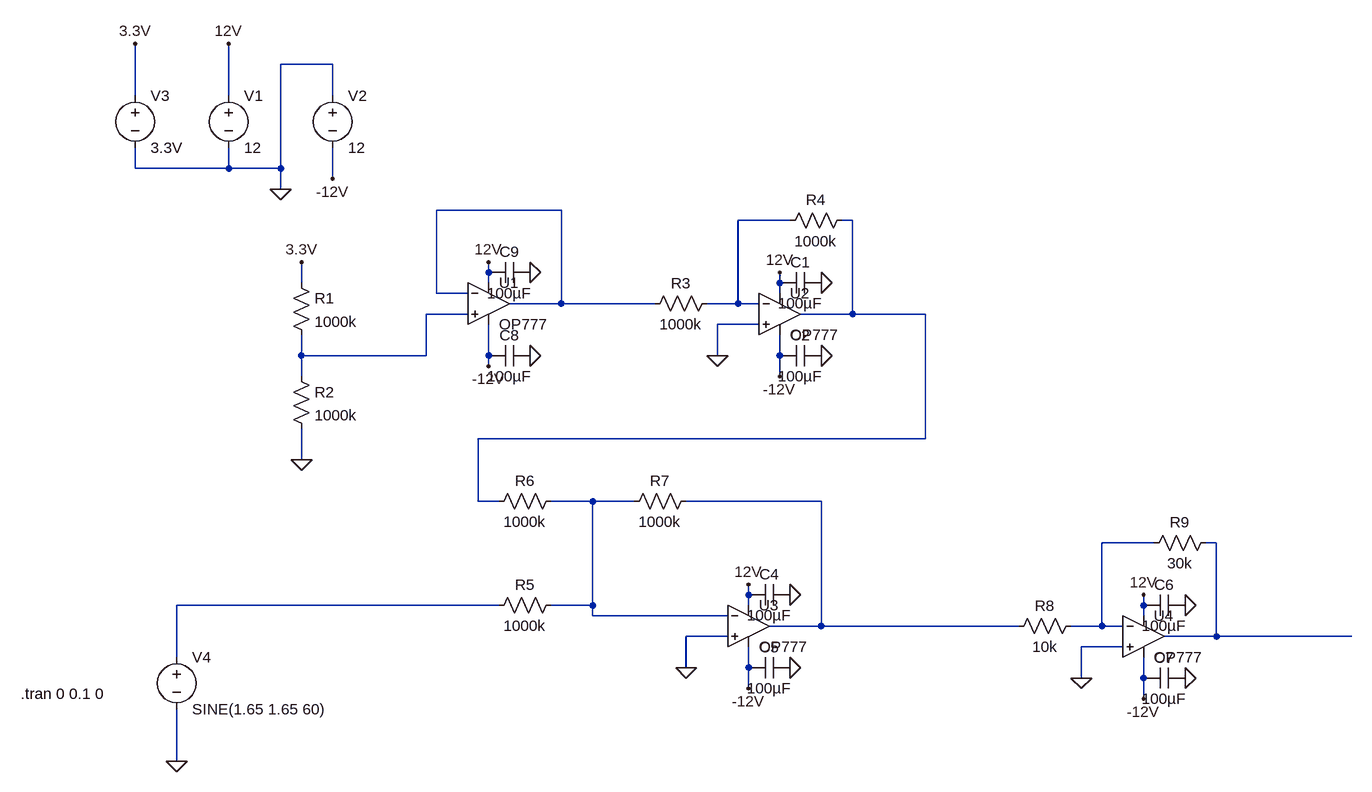
[diagram p0: schematic Output.asc]
Output.asc, the LTspice schematic file:
Version 4
SHEET 1 2004 912
WIRE -48 -192 -128 -192
WIRE -352 -144 -352 -224
WIRE -208 -144 -208 -224
WIRE -48 -144 -48 -192
WIRE -352 -32 -352 -64
WIRE -208 -32 -208 -64
WIRE -208 -32 -352 -32
WIRE -128 -32 -128 -192
WIRE -128 -32 -208 -32
WIRE -48 -16 -48 -64
WIRE -128 0 -128 -32
WIRE 304 32 112 32
WIRE 656 48 576 48
WIRE 752 48 736 48
WIRE 192 128 192 112
WIRE -96 144 -96 112
WIRE 192 144 192 128
WIRE 640 144 640 128
WIRE 112 160 112 32
WIRE 160 160 112 160
WIRE 640 160 640 144
WIRE 304 176 304 32
WIRE 304 176 224 176
WIRE 448 176 304 176
WIRE 576 176 576 48
WIRE 576 176 528 176
WIRE 608 176 576 176
WIRE 160 192 96 192
WIRE 752 192 752 48
WIRE 752 192 672 192
WIRE 864 192 752 192
WIRE 608 208 544 208
WIRE -96 256 -96 224
WIRE 96 256 96 192
WIRE 96 256 -96 256
WIRE 192 256 192 208
WIRE 544 256 544 208
WIRE 640 256 640 224
WIRE 192 272 192 256
WIRE -96 288 -96 256
WIRE 640 288 640 256
WIRE 864 384 864 192
WIRE 864 384 176 384
WIRE -96 416 -96 368
WIRE 176 480 176 384
WIRE 208 480 176 480
WIRE 352 480 288 480
WIRE 416 480 352 480
WIRE 704 480 496 480
WIRE 1216 544 1136 544
WIRE 1312 544 1296 544
WIRE 592 624 592 608
WIRE 208 640 -288 640
WIRE 352 640 352 480
WIRE 352 640 288 640
WIRE 592 640 592 624
WIRE 1200 640 1200 624
WIRE 352 656 352 640
WIRE 560 656 352 656
WIRE 1200 656 1200 640
WIRE 704 672 704 480
WIRE 704 672 624 672
WIRE 1008 672 704 672
WIRE 1136 672 1136 544
WIRE 1136 672 1088 672
WIRE 1168 672 1136 672
WIRE 560 688 496 688
WIRE 1312 688 1312 544
WIRE 1312 688 1232 688
WIRE 1520 688 1312 688
WIRE 1168 704 1104 704
WIRE -288 720 -288 640
WIRE 496 736 496 688
WIRE 592 736 592 704
WIRE 1104 752 1104 704
WIRE 1200 752 1200 720
WIRE 592 768 592 736
WIRE 1200 784 1200 752
WIRE -288 880 -288 800
FLAG -128 0 0
FLAG -208 -224 12V
FLAG -48 -16 -12V
FLAG 192 272 -12V
FLAG 192 112 12V
FLAG -352 -224 3.3V
FLAG -96 112 3.3V
FLAG -96 416 0
FLAG -288 880 0
FLAG 592 768 -12V
FLAG 592 608 12V
FLAG 1200 784 -12V
FLAG 1200 624 12V
FLAG 496 736 0
FLAG 1104 752 0
FLAG 656 624 0
FLAG 656 736 0
FLAG 1264 640 0
FLAG 1264 752 0
FLAG 256 256 0
FLAG 256 128 0
FLAG 640 288 -12V
FLAG 640 128 12V
FLAG 544 256 0
FLAG 704 144 0
FLAG 704 256 0
SYMBOL voltage -208 -160 R0
WINDOW 123 0 0 Left 0
WINDOW 39 0 0 Left 0
SYMATTR InstName V1
SYMATTR Value 12
SYMBOL voltage -48 -160 R0
WINDOW 123 0 0 Left 0
WINDOW 39 0 0 Left 0
SYMATTR InstName V2
SYMATTR Value 12
SYMBOL voltage -352 -160 R0
WINDOW 123 0 0 Left 0
WINDOW 39 0 0 Left 0
SYMATTR InstName V3
SYMATTR Value 3.3V
SYMBOL res -112 128 R0
SYMATTR InstName R1
SYMATTR Value 1000k
SYMBOL res -112 272 R0
SYMATTR InstName R2
SYMATTR Value 1000k
SYMBOL voltage -288 704 R0
WINDOW 123 0 0 Left 0
WINDOW 39 0 0 Left 0
SYMATTR InstName V4
SYMATTR Value SINE(1.65 1.65 60)
SYMBOL res 304 624 R90
WINDOW 0 0 56 VBottom 2
WINDOW 3 32 56 VTop 2
SYMATTR InstName R5
SYMATTR Value 1000k
SYMBOL res 304 464 R90
WINDOW 0 0 56 VBottom 2
WINDOW 3 32 56 VTop 2
SYMATTR InstName R6
SYMATTR Value 1000k
SYMBOL res 512 464 R90
WINDOW 0 0 56 VBottom 2
WINDOW 3 32 56 VTop 2
SYMATTR InstName R7
SYMATTR Value 1000k
SYMBOL res 1104 656 R90
WINDOW 0 0 56 VBottom 2
WINDOW 3 32 56 VTop 2
SYMATTR InstName R8
SYMATTR Value 10k
SYMBOL res 1312 528 R90
WINDOW 0 0 56 VBottom 2
WINDOW 3 32 56 VTop 2
SYMATTR InstName R9
SYMATTR Value 30k
SYMBOL cap 656 608 R90
WINDOW 0 0 32 VBottom 2
WINDOW 3 32 32 VTop 2
SYMATTR InstName C4
SYMATTR Value 100µF
SYMBOL cap 656 720 R90
WINDOW 0 0 32 VBottom 2
WINDOW 3 32 32 VTop 2
SYMATTR InstName C5
SYMATTR Value 100µF
SYMBOL cap 1264 624 R90
WINDOW 0 0 32 VBottom 2
WINDOW 3 32 32 VTop 2
SYMATTR InstName C6
SYMATTR Value 100µF
SYMBOL cap 1264 736 R90
WINDOW 0 0 32 VBottom 2
WINDOW 3 32 32 VTop 2
SYMATTR InstName C7
SYMATTR Value 100µF
SYMBOL cap 256 240 R90
WINDOW 0 0 32 VBottom 2
WINDOW 3 32 32 VTop 2
SYMATTR InstName C8
SYMATTR Value 100µF
SYMBOL cap 256 112 R90
WINDOW 0 0 32 VBottom 2
WINDOW 3 32 32 VTop 2
SYMATTR InstName C9
SYMATTR Value 100µF
SYMBOL Opamps\\OP777 192 112 R0
SYMATTR InstName U1
SYMBOL Opamps\\OP777 592 608 R0
SYMATTR InstName U3
SYMBOL Opamps\\OP777 1200 624 R0
SYMATTR InstName U4
SYMBOL res 544 160 R90
WINDOW 0 0 56 VBottom 2
WINDOW 3 32 56 VTop 2
SYMATTR InstName R3
SYMATTR Value 1000k
SYMBOL res 752 32 R90
WINDOW 0 0 56 VBottom 2
WINDOW 3 32 56 VTop 2
SYMATTR InstName R4
SYMATTR Value 1000k
SYMBOL cap 704 128 R90
WINDOW 0 0 32 VBottom 2
WINDOW 3 32 32 VTop 2
SYMATTR InstName C1
SYMATTR Value 100µF
SYMBOL cap 704 240 R90
WINDOW 0 0 32 VBottom 2
WINDOW 3 32 32 VTop 2
SYMATTR InstName C2
SYMATTR Value 100µF
SYMBOL Opamps\\OP777 640 128 R0
SYMATTR InstName U2
TEXT -528 776 Left 2 !.tran 0 0.1 0

The netlist it stands for:
* Output.asc
V1 12V 0 12
V2 0 -12V 12
V3 3.3V 0 3.3V
R1 3.3V N004 1000k
R2 N004 0 1000k
V4 N009 0 SINE(1.65 1.65 60)
R5 N005 N009 1000k
R6 N005 N003 1000k
R7 N006 N005 1000k
R8 N007 N006 10k
R9 N008 N007 30k
C4 0 12V 100µF
C5 0 -12V 100µF
C6 0 12V 100µF
C7 0 -12V 100µF
C8 0 -12V 100µF
C9 0 12V 100µF
XU1 N004 N001 12V -12V N001 OP777  ; pins In+ In- V+ V- OUT
XU3 0 N005 12V -12V N006 OP777  ; pins In+ In- V+ V- OUT
XU4 0 N007 12V -12V N008 OP777  ; pins In+ In- V+ V- OUT
R3 N002 N001 1000k
R4 N003 N002 1000k
C1 0 12V 100µF
C2 0 -12V 100µF
XU2 0 N002 12V -12V N003 OP777  ; pins In+ In- V+ V- OUT
.tran 0 0.1 0
.lib ADI.lib
.backanno
.end